# EAGLE schematic schematic (EAGLE 7.5.0)
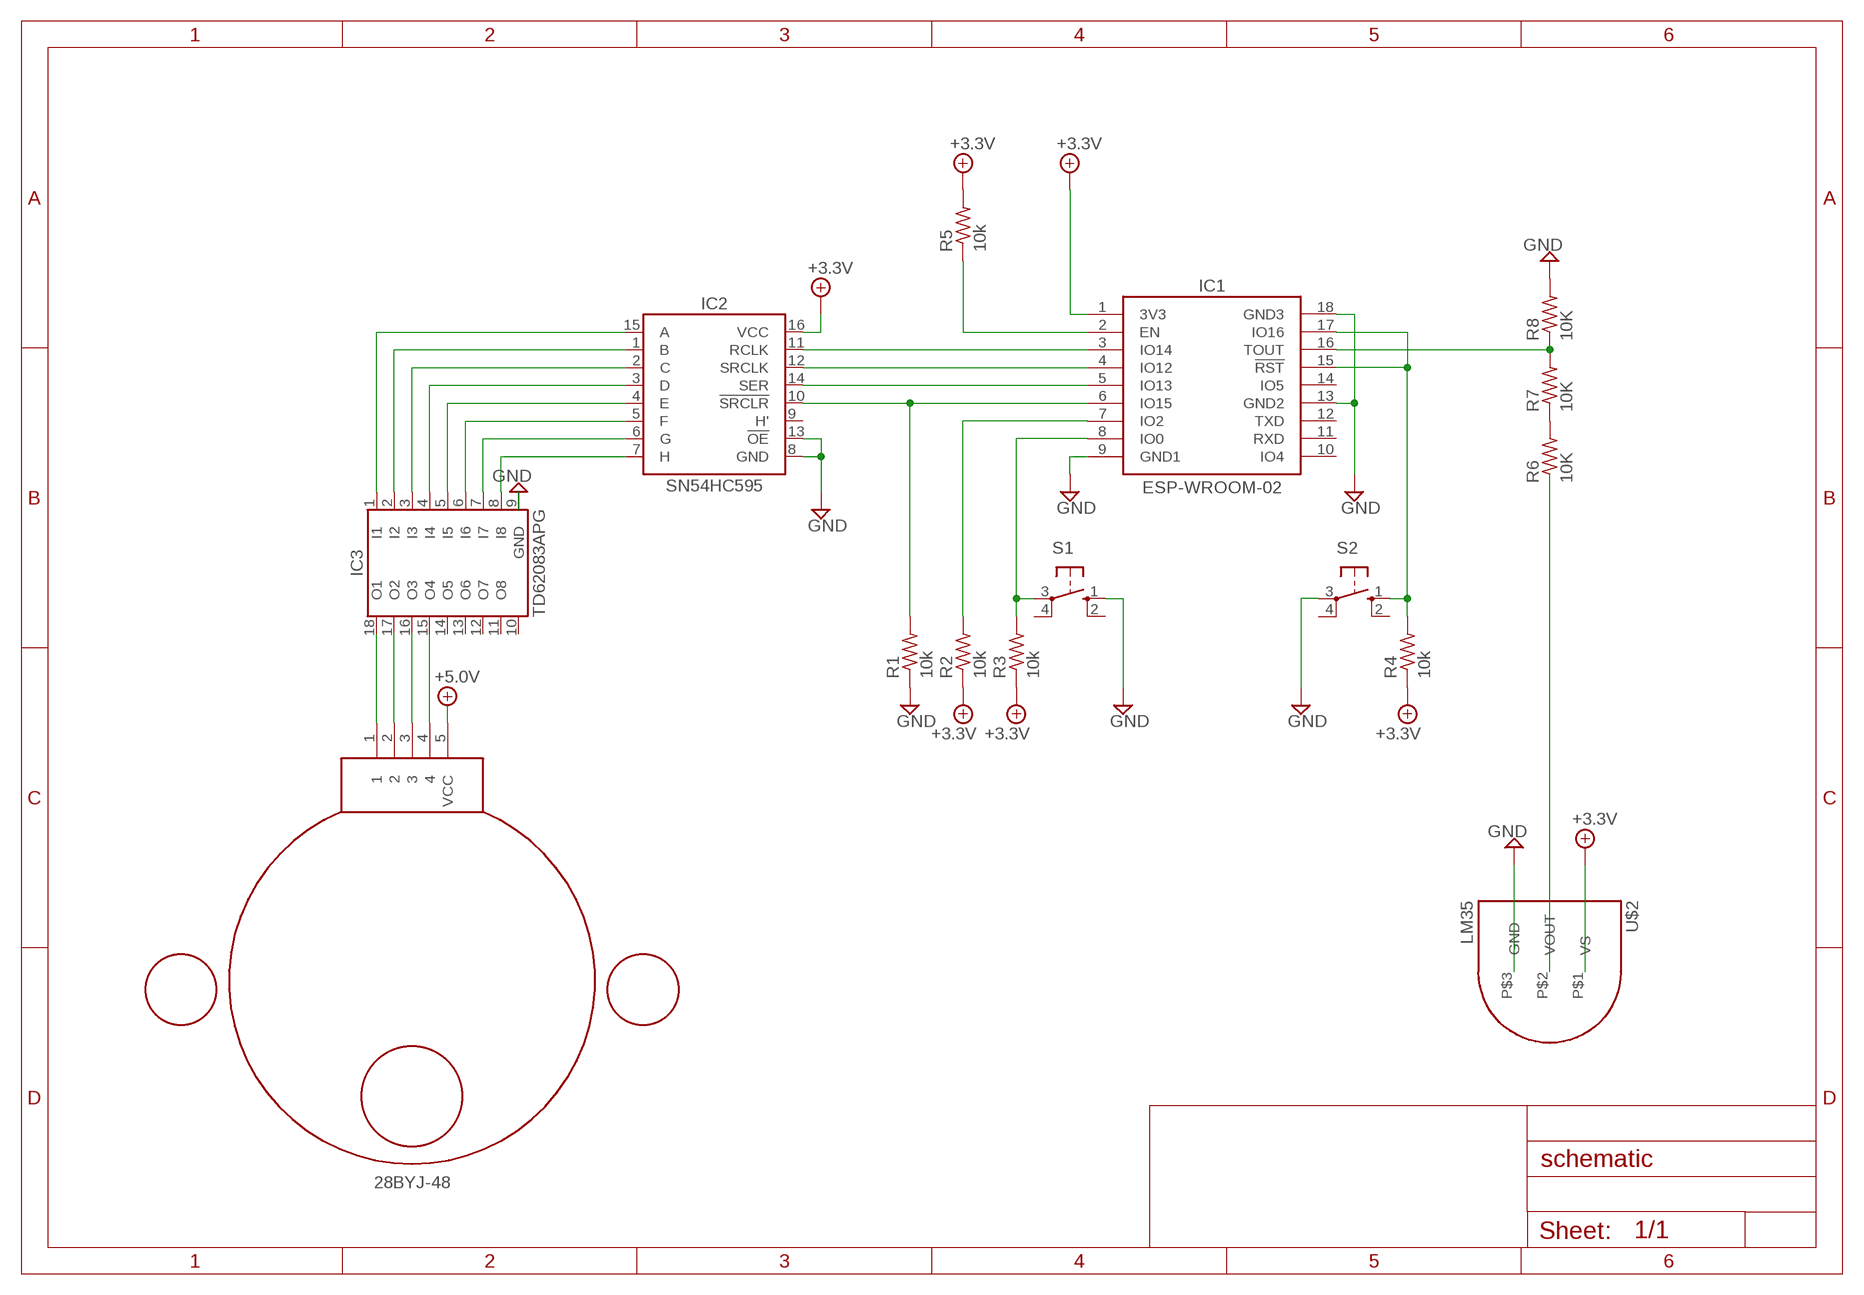
[diagram p0: schematic, sheet 1]

## Parts
IC1  ESP-WROOM-02  [WROOM-02]
IC2  SN54HC595  [SN54HC595]
IC3  TD62083APG  [TD62083APG]
R1  10k  R  [0309/12]
R2  10k  R  [0309/12]
R3  10k  R  [0309/12]
R4  10k  R  [0309/12]
R5  10k  R  [0309/12]
R6  10K  R  [0309/12]
R7  10K  R  [0309/12]
R8  10K  R  [0309/12]
S1  10-XX(タクトスイッチ)  [B3F-10XX]
S2  10-XX(タクトスイッチ)  [B3F-10XX]
U$1  28BYJ-48  [28BYJ-48]
U$2  LM35  [LM35]

## Nets
+3.3V: IC1.1(3V3) IC2.16(VCC) R2.1 R3.1 R4.1 R5.2 U$2.P$1(VS)
GND: IC2.8(GND) IC2.13(!OE!) IC3.9(GND) R1.1 R8.2 S1.1(S) S2.3(P) U$2.P$3(GND)
GND1: IC1.9(GND1) ; supply symbol labelled GND
GND3: IC1.13(GND2) IC1.18(GND3) ; supply symbol labelled GND
N$1: IC1.6(IO15) IC2.10(!SRCLR!) R1.2
N$2: IC1.5(IO13) IC2.14(SER)
N$3: IC1.4(IO12) IC2.12(SRCLK)
N$4: IC1.15(!RST!) IC1.17(IO16) R4.2 S2.1(S)
N$5: IC1.7(IO2) R2.2
N$6: IC2.1(B) IC3.2(I2)
N$7: R6.1 U$2.P$2(VOUT)
N$8: IC1.3(IO14) IC2.11(RCLK)
N$9: IC3.18(O1) U$1.1
N$10: IC1.8(IO0) R3.2 S1.3(P)
N$11: IC3.17(O2) U$1.2
N$12: IC3.16(O3) U$1.3
N$13: IC3.15(O4) U$1.4
N$14: U$1.5(VCC)
N$15: IC1.2(EN) R5.1
N$16: IC2.15(A) IC3.1(I1)
N$17: IC1.16(TOUT) R7.2 R8.1
N$18: IC2.2(C) IC3.3(I3)
N$19: IC2.3(D) IC3.4(I4)
N$20: IC2.4(E) IC3.5(I5)
N$21: IC2.6(G) IC3.7(I7)
N$22: IC2.5(F) IC3.6(I6)
N$23: IC2.7(H) IC3.8(I8)
N$24: R6.2 R7.1
Unconnected: IC1.10(IO4) IC1.11(RXD) IC1.12(TXD) IC1.14(IO5) IC2.9(H') IC3.11(O8) IC3.12(O7) IC3.13(O6) IC3.14(O5) S1.2(S1) S1.4(P1) S2.2(S1) S2.4(P1)

## Power pins joined to a net without a drawn wire
COMMON: IC3.10(COMMON)

## Library data of the parts
IC1 = library:ESP-WROOM-02: ESP8266 WROOM-02
IC2 = library:SN54HC595: Dual In Line / Socket
IC3 = library:TD62083APG: Dual In Line / Socket
R1-R5 = MyLibraries:R
R6-R8 = distance:R: 抵抗
S1 S2 = MyLibraries:10-XX(タクトスイッチ): OMRON SWITCH 秋月電子 <http://akizukidenshi.com/catalog/g/gP-03648/>; MPN: B3F-1000; OC_FARNELL: 176432; OC_NEWARK: 36M3542
U$1 = library:28BYJ-48
U$2 = distance:LM35: 温度センサー